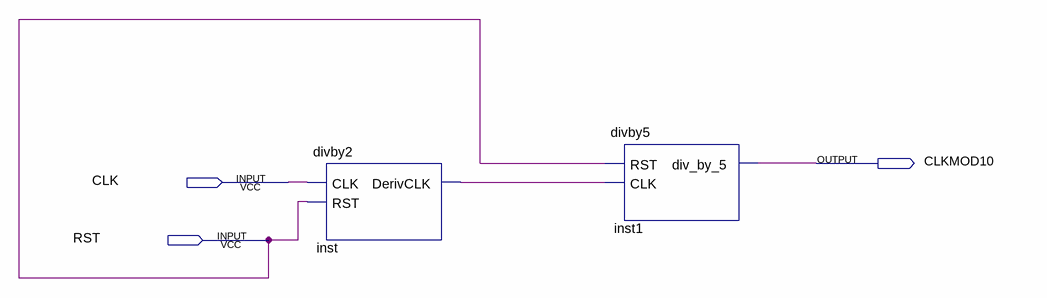
[diagram p0: schematic sheet]
// Quartus schematic divby10.bdf as structural Verilog: 2 symbols, 3 pins
module divby10 (
  input  CLK,
  input  RST,
  output CLKMOD10
);

  wire inst_derivclk;

  divby2 inst (.CLK(CLK), .RST(RST), .DerivCLK(inst_derivclk));
  divby5 inst1 (.RST(RST), .CLK(inst_derivclk), .div_by_5(CLKMOD10));
endmodule
